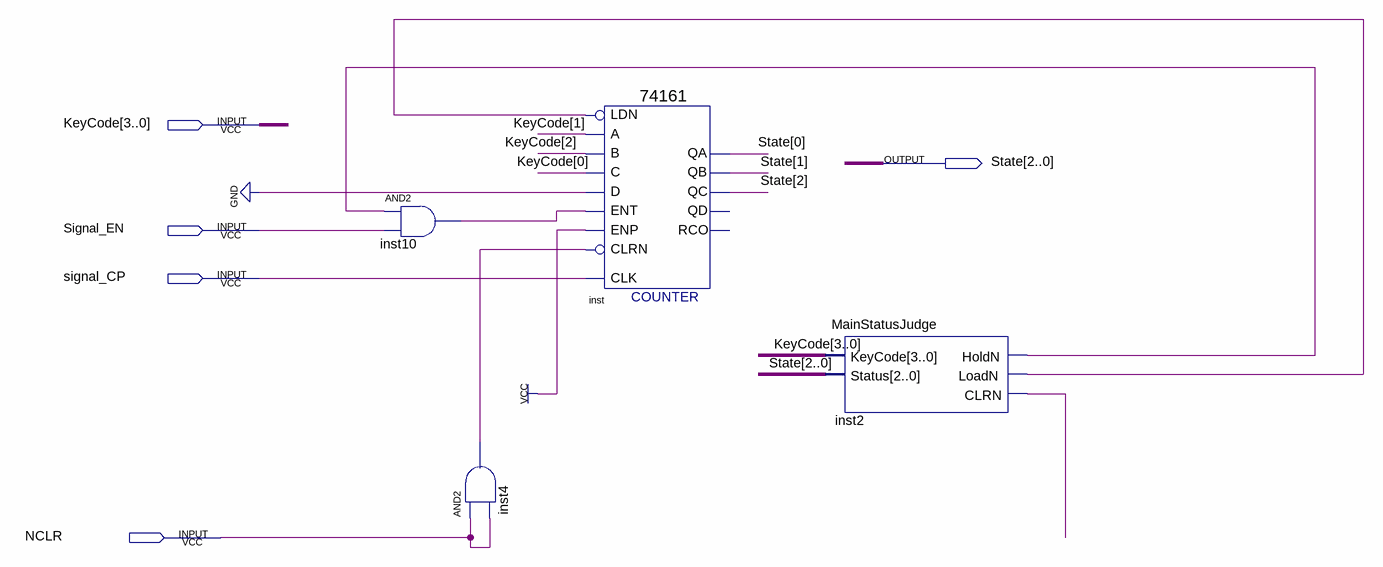
[diagram p0: schematic sheet]
// Quartus schematic MainStatusMachine.bdf as structural Verilog: 4 symbols, 5 pins
module MainStatusMachine (
  input  [3:0] KeyCode,
  input  Signal_EN,
  input  signal_CP,
  input  NCLR,
  output [2:0] State
);

  wire inst2_clrn, inst2_holdn, inst2_loadn, inst4_out, inst10_out;

  and inst10 (inst10_out, inst2_holdn, Signal_EN);
  and inst4 (inst4_out, NCLR, NCLR);
  \74161  inst (
    .CLRN(inst4_out), .CLK(signal_CP), .ENP(1'b1), .LDN(inst2_loadn), .A(KeyCode[1]), .D(1'b0),
    .ENT(inst10_out), .B(KeyCode[2]), .C(KeyCode[0]), .QC(State[2]), .QB(State[1]), .QA(State[0]));  // open: QD, RCO
  MainStatusJudge inst2 (
    .KeyCode(KeyCode), .Status(State), .HoldN(inst2_holdn), .LoadN(inst2_loadn), .CLRN(inst2_clrn));
endmodule
